# Altium project Master v2.PrjPCB
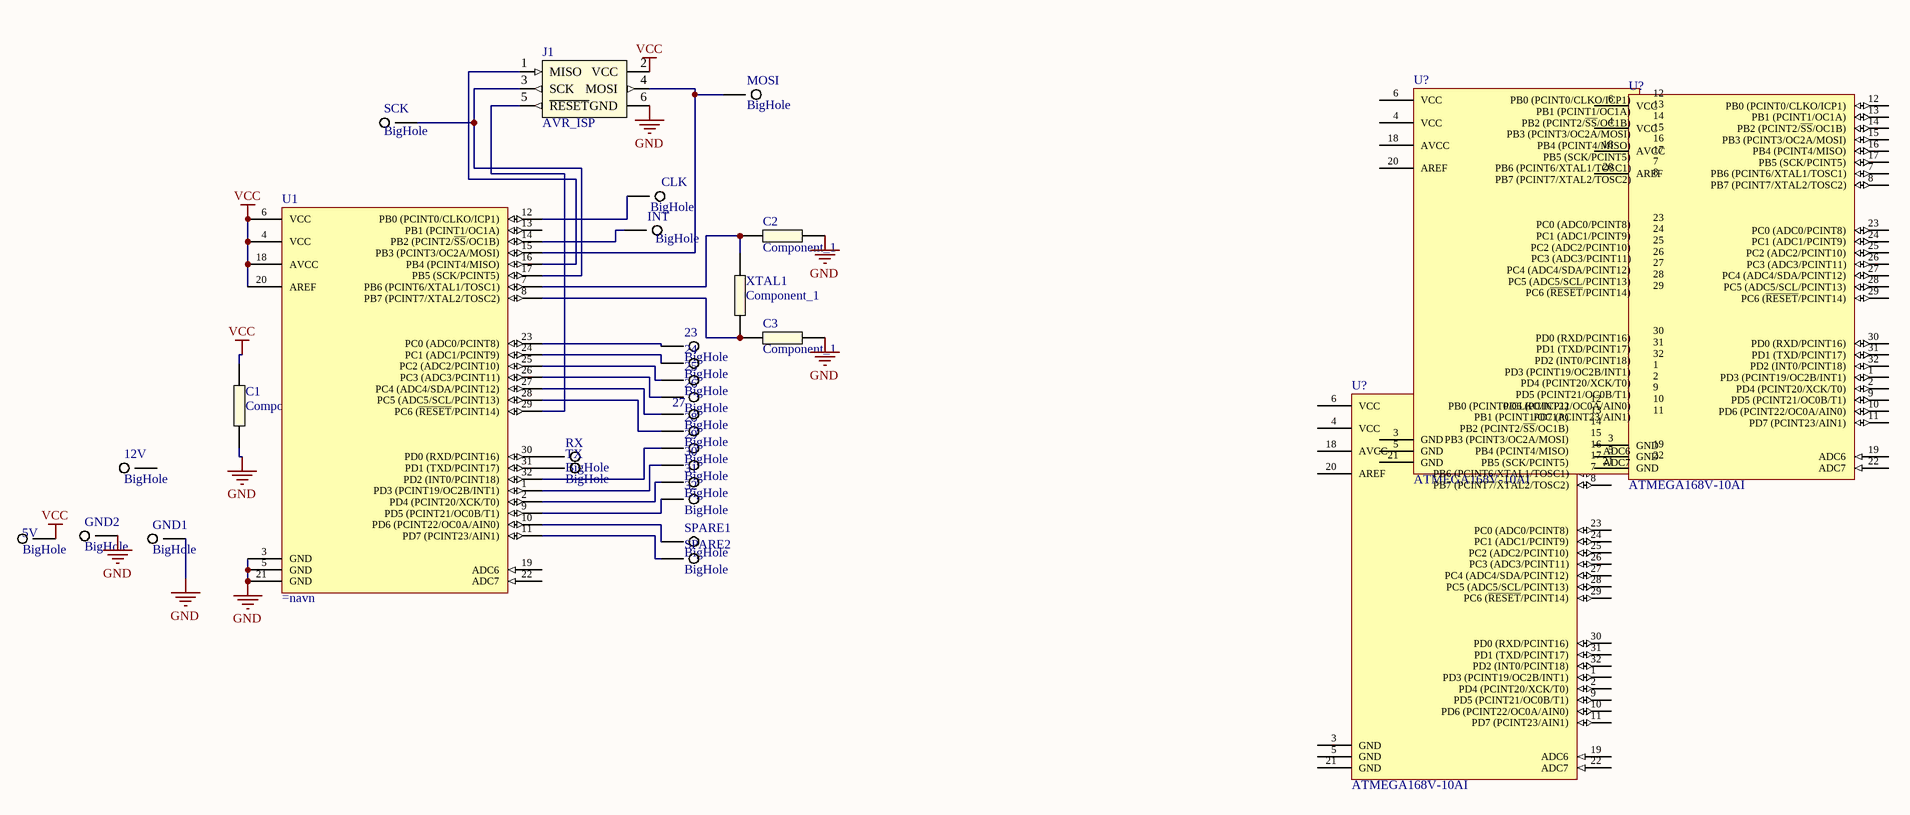
[diagram p0: Master v2.SchDoc]
1 sheet, 31 parts. Net scope: global (net labels, ports and power ports of the same name join across sheets).
Board file: Master v2.PcbDoc

## Sheet Master v2.SchDoc
size A3

### Parts
(Parts that share a designator on the sheet are numbered #1, #2 ... from top to bottom, then left to right.)
5V  BigHole  [MEDHOLE]
12V  BigHole  [MEDHOLE]
23  BigHole  [MEDHOLE]
24  BigHole  [MEDHOLE]
25  BigHole  [MEDHOLE]
26  BigHole  [MEDHOLE]
27  BigHole  [MEDHOLE]
28  BigHole  [MEDHOLE]
29  BigHole  [MEDHOLE]
30  BigHole  [MEDHOLE]
31  BigHole  [MEDHOLE]
32  BigHole  [MEDHOLE]
C1  Component_1  [200mil]
C2  Component_1  [200mil]
C3  Component_1  [200mil]
CLK  BigHole  [MEDHOLE]
GND1  BigHole  [MEDHOLE]
GND2  BigHole  [MEDHOLE]
INT  BigHole  [MEDHOLE]
J1  AVR_ISP  [HEADER6]
MOSI  BigHole  [MEDHOLE]
RX  BigHole  [MEDHOLE]
SCK  BigHole  [MEDHOLE]
SPARE1  BigHole  [MEDHOLE]
SPARE2  BigHole  [MEDHOLE]
TX  BigHole  [MEDHOLE]
U1  (no value)  [TQFP80P900X900X120]
U?#1  ATMEGA168V-10AI  [TQFP80P900X900X120-32N]
U?#2  ATMEGA168V-10AI  [TQFP80P900X900X120-32N]
U?#3  ATMEGA168V-10AI  [TQFP80P900X900X120-32N]
XTAL1  Component_1  [200mil]

### Nets
GND: C1.1 C2.1 C3.1 GND1.1(Pin?) GND2.1(Pin?) J1.6(GND) U1.3(GND) U1.5(GND) U1.21(GND)
VCC: 5V.1(Pin?) C1.2 J1.2(VCC) U1.4(VCC) U1.6(VCC) U1.18(AVCC) U1.20(AREF)
Net23_1: 23.1(Pin?) U1.23(PC0_(ADC0/PCINT8))
Net24_1: 24.1(Pin?) U1.24(PC1_(ADC1/PCINT9))
Net25_1: 25.1(Pin?) U1.25(PC2_(ADC2/PCINT10))
Net26_1: 26.1(Pin?) U1.26(PC3_(ADC3/PCINT11))
Net27_1: 27.1(Pin?) U1.27(PC4_(ADC4/SDA/PCINT12))
Net28_1: 28.1(Pin?) U1.28(PC5_(ADC5/SCL/PCINT13))
Net29_1: 29.1(Pin?) U1.32(PD2_(INT0/PCINT18))
Net30_1: 30.1(Pin?) U1.1(PD3_(PCINT19/OC2B/INT1))
Net31_1: 31.1(Pin?) U1.2(PD4_(PCINT20/XCK/T0))
Net32_1: 32.1(Pin?) U1.9(PD5_(PCINT21/OC0B/T1))
NetC2_2: C2.2 U1.7(PB6_(PCINT6/XTAL1/TOSC1)) XTAL1.1
NetC3_2: C3.2 U1.8(PB7_(PCINT7/XTAL2/TOSC2)) XTAL1.2
NetCLK_1: CLK.1(Pin?) U1.12(PB0_(PCINT0/CLKO/ICP1))
NetINT_1: INT.1(Pin?) U1.14(PB2_(PCINT2/~{SS}/OC1B))
NetJ1_1: J1.1(MISO) U1.16(PB4_(PCINT4/MISO))
NetJ1_3: J1.3(SCK) SCK.1(Pin?) U1.17(PB5_(SCK/PCINT5))
NetJ1_4: J1.4(MOSI) MOSI.1(Pin?) U1.15(PB3_(PCINT3/OC2A/MOSI))
NetJ1_5: J1.5(~{RESET}) U1.29(PC6_(~{RESET}/PCINT14))
NetRX_1: RX.1(Pin?) U1.30(PD0_(RXD/PCINT16))
NetSPARE1_1: SPARE1.1(Pin?) U1.10(PD6_(PCINT22/OC0A/AIN0))
NetSPARE2_1: SPARE2.1(Pin?) U1.11(PD7_(PCINT23/AIN1))
NetTX_1: TX.1(Pin?) U1.31(PD1_(TXD/PCINT17))

Not connected (* = marked no-connect by the designer): 12V 1(Pin?); U1 13(PB1_(PCINT1/OC1A)) 19(ADC6) 22(ADC7); U?#1 1(PD3_(PCINT19/OC2B/INT1)) 2(PD4_(PCINT20/XCK/T0)) 3(GND) 4(VCC) 5(GND) 6(VCC) 7(PB6_(PCINT6/XTAL1/TOSC1)) 8(PB7_(PCINT7/XTAL2/TOSC2)) 9(PD5_(PCINT21/OC0B/T1)) 10(PD6_(PCINT22/OC0A/AIN0)) 11(PD7_(PCINT23/AIN1)) 12(PB0_(PCINT0/CLKO/ICP1)) 13(PB1_(PCINT1/OC1A)) 14(PB2_(PCINT2/~{SS}/OC1B)) 15(PB3_(PCINT3/OC2A/MOSI)) 16(PB4_(PCINT4/MISO)) 17(PB5_(SCK/PCINT5)) 18(AVCC) 19(ADC6) 20(AREF) 21(GND) 22(ADC7) 23(PC0_(ADC0/PCINT8)) 24(PC1_(ADC1/PCINT9)) 25(PC2_(ADC2/PCINT10)) 26(PC3_(ADC3/PCINT11)) 27(PC4_(ADC4/SDA/PCINT12)) 28(PC5_(ADC5/SCL/PCINT13)) 29(PC6_(~{RESET}/PCINT14)) 30(PD0_(RXD/PCINT16)) 31(PD1_(TXD/PCINT17)) 32(PD2_(INT0/PCINT18)); U?#2 1(PD3_(PCINT19/OC2B/INT1)) 2(PD4_(PCINT20/XCK/T0)) 3(GND) 4(VCC) 5(GND) 6(VCC) 7(PB6_(PCINT6/XTAL1/TOSC1)) 8(PB7_(PCINT7/XTAL2/TOSC2)) 9(PD5_(PCINT21/OC0B/T1)) 10(PD6_(PCINT22/OC0A/AIN0)) 11(PD7_(PCINT23/AIN1)) 12(PB0_(PCINT0/CLKO/ICP1)) 13(PB1_(PCINT1/OC1A)) 14(PB2_(PCINT2/~{SS}/OC1B)) 15(PB3_(PCINT3/OC2A/MOSI)) 16(PB4_(PCINT4/MISO)) 17(PB5_(SCK/PCINT5)) 18(AVCC) 19(ADC6) 20(AREF) 21(GND) 22(ADC7) 23(PC0_(ADC0/PCINT8)) 24(PC1_(ADC1/PCINT9)) 25(PC2_(ADC2/PCINT10)) 26(PC3_(ADC3/PCINT11)) 27(PC4_(ADC4/SDA/PCINT12)) 28(PC5_(ADC5/SCL/PCINT13)) 29(PC6_(~{RESET}/PCINT14)) 30(PD0_(RXD/PCINT16)) 31(PD1_(TXD/PCINT17)) 32(PD2_(INT0/PCINT18)); U?#3 1(PD3_(PCINT19/OC2B/INT1)) 2(PD4_(PCINT20/XCK/T0)) 3(GND) 4(VCC) 5(GND) 6(VCC) 7(PB6_(PCINT6/XTAL1/TOSC1)) 8(PB7_(PCINT7/XTAL2/TOSC2)) 9(PD5_(PCINT21/OC0B/T1)) 10(PD6_(PCINT22/OC0A/AIN0)) 11(PD7_(PCINT23/AIN1)) 12(PB0_(PCINT0/CLKO/ICP1)) 13(PB1_(PCINT1/OC1A)) 14(PB2_(PCINT2/~{SS}/OC1B)) 15(PB3_(PCINT3/OC2A/MOSI)) 16(PB4_(PCINT4/MISO)) 17(PB5_(SCK/PCINT5)) 18(AVCC) 19(ADC6) 20(AREF) 21(GND) 22(ADC7) 23(PC0_(ADC0/PCINT8)) 24(PC1_(ADC1/PCINT9)) 25(PC2_(ADC2/PCINT10)) 26(PC3_(ADC3/PCINT11)) 27(PC4_(ADC4/SDA/PCINT12)) 28(PC5_(ADC5/SCL/PCINT13)) 29(PC6_(~{RESET}/PCINT14)) 30(PD0_(RXD/PCINT16)) 31(PD1_(TXD/PCINT17)) 32(PD2_(INT0/PCINT18))

### Library data of the parts
U1 = ATMEGA168V
U?#1-U?#3 = 2242: id: 2242; rad: 1; rom: OV; lager_type: Fremlager; dybde: 2; hylle: 3; antall: 0; pakke_opprettet_av: 1335; beskrivelse: Mikrokontroller; produsent: Atmel; pakketype: TQFP; kolonne: 3; pakke_opprettet: 2016-03-11 13:28:05; symbol_opprettet_av: 1335; symbol_opprettet: 2016-03-11 13:26:28; navn: ATMEGA168V-10AI; pris: 0